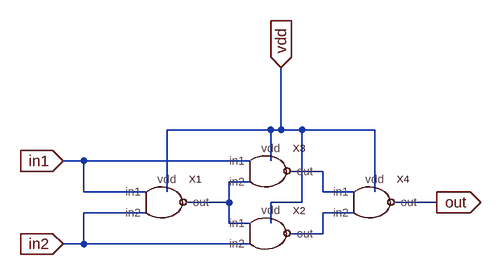
[diagram p0: schematic xor.asc]
xor.asc, the LTspice schematic file:
Version 4
SHEET 1 880 680
WIRE 240 48 80 48
WIRE 256 48 256 -48
WIRE 256 48 240 48
WIRE 288 48 256 48
WIRE 400 48 288 48
WIRE -48 96 -80 96
WIRE 208 96 -48 96
WIRE 240 96 240 48
WIRE 320 112 272 112
WIRE 208 128 176 128
WIRE -48 144 -48 96
WIRE 48 144 -48 144
WIRE 80 144 80 48
WIRE 320 144 320 112
WIRE 368 144 320 144
WIRE 400 144 400 48
WIRE 176 160 176 128
WIRE 176 160 112 160
WIRE 288 160 288 48
WIRE 288 160 240 160
WIRE 496 160 432 160
WIRE 48 176 -48 176
WIRE 368 176 320 176
WIRE 176 192 176 160
WIRE 208 192 176 192
WIRE 240 192 240 160
WIRE 320 208 320 176
WIRE 320 208 272 208
WIRE -48 224 -48 176
WIRE -48 224 -80 224
WIRE 208 224 -48 224
FLAG -80 224 in2
IOPIN -80 224 In
FLAG -80 96 in1
IOPIN -80 96 In
FLAG 256 -48 vdd
IOPIN 256 -48 In
FLAG 496 160 out
IOPIN 496 160 Out
SYMBOL nand 64 160 R0
SYMATTR InstName X1
SYMBOL nand 224 208 R0
SYMATTR InstName X2
SYMBOL nand 224 112 R0
SYMATTR InstName X3
SYMBOL nand 384 160 R0
SYMATTR InstName X4

The netlist it stands for:
* xor.asc
XX1 in1 in2 N002 vdd nand  ; pins in1 in2 out vdd
XX2 N002 in2 N003 vdd nand  ; pins in1 in2 out vdd
XX3 in1 N002 N001 vdd nand  ; pins in1 in2 out vdd
XX4 N001 N003 out vdd nand  ; pins in1 in2 out vdd
.backanno
.end